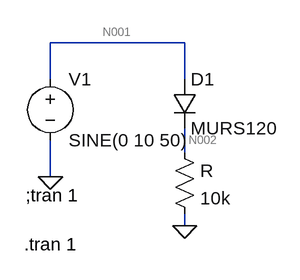
[diagram p0: schematic 1_1.asc]
1_1.asc, the LTspice schematic file:
Version 4
SHEET 1 880 680
WIRE 144 96 -32 96
WIRE -32 144 -32 96
WIRE 144 144 144 96
WIRE 144 240 144 208
WIRE -32 272 -32 224
WIRE 144 336 144 320
FLAG -32 272 0
FLAG 144 336 0
SYMBOL diode 128 144 R0
SYMATTR InstName D1
SYMATTR Value MURS120
SYMBOL voltage -32 128 R0
WINDOW 123 0 0 Left 0
WINDOW 39 0 0 Left 0
SYMATTR InstName V1
SYMATTR Value SINE(0 10 50)
SYMBOL res 128 224 R0
SYMATTR InstName R
SYMATTR Value 10k
TEXT -64 296 Left 2 !;tran 1
TEXT -66 360 Left 2 !.tran 1

The netlist it stands for:
* 1_1.asc
D1 N001 N002 MURS120
V1 N001 0 SINE(0 10 50)
R N002 0 10k
.model D D
.lib standard.dio
;tran 1
.tran 1
.backanno
.end

* Results of the author's LTspice run, read from the files saved beside the schematic
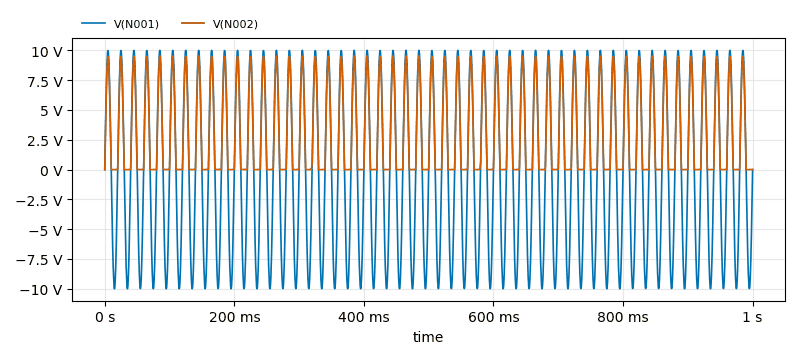
[diagram p1: Transient Analysis of 1_1.asc, plotted from the saved traces]
* Transient Analysis, 1 run:
*   V(N001): min -10 V, max 10 V, average 85.78 µV, rms 7.07 V, last 0 V
*   V(N002): min -1.594 mV, max 9.521 V, average 2.924 V, rms 4.662 V, last 1.107 mV